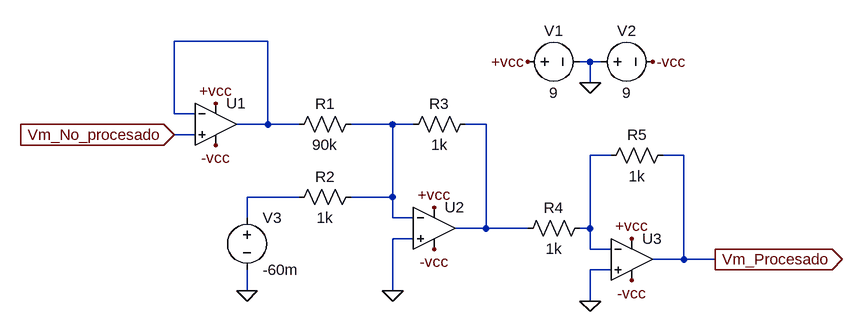
[diagram p0: schematic Modulo-Procesamiento.asc]
Modulo-Procesamiento.asc, the LTspice schematic file:
Version 4
SHEET 1 2272 680
WIRE 1264 -112 1120 -112
WIRE 1760 -80 1744 -80
WIRE 1776 -80 1760 -80
WIRE 1760 -48 1760 -80
WIRE 1120 0 1120 -112
WIRE 1152 0 1120 0
WIRE 1264 16 1264 -112
WIRE 1264 16 1216 16
WIRE 1312 16 1264 16
WIRE 1456 16 1392 16
WIRE 1488 16 1456 16
WIRE 1600 16 1568 16
WIRE 1152 32 1120 32
WIRE 1792 64 1760 64
WIRE 1904 64 1872 64
WIRE 1312 128 1232 128
WIRE 1456 128 1456 16
WIRE 1456 128 1392 128
WIRE 1232 160 1232 128
WIRE 1456 160 1456 128
WIRE 1488 160 1456 160
WIRE 1600 176 1600 16
WIRE 1600 176 1552 176
WIRE 1664 176 1600 176
WIRE 1760 176 1760 64
WIRE 1760 176 1744 176
WIRE 1488 192 1456 192
WIRE 1760 208 1760 176
WIRE 1792 208 1760 208
WIRE 1904 224 1904 64
WIRE 1904 224 1856 224
WIRE 1952 224 1904 224
WIRE 1792 240 1760 240
WIRE 1232 272 1232 240
WIRE 1456 272 1456 192
WIRE 1760 288 1760 240
FLAG 1760 -48 0
FLAG 1664 -80 +vcc
FLAG 1856 -80 -vcc
FLAG 1184 -16 +vcc
FLAG 1184 48 -vcc
FLAG 1456 272 0
FLAG 1232 272 0
FLAG 1520 208 -vcc
FLAG 1520 144 +vcc
FLAG 1824 256 -vcc
FLAG 1824 192 +vcc
FLAG 1760 288 0
FLAG 1952 224 Vm_Procesado
IOPIN 1952 224 Out
FLAG 1120 32 Vm_No_procesado
IOPIN 1120 32 In
SYMBOL OpAmps\\UniversalOpAmp 1184 16 R0
SYMATTR InstName U1
SYMBOL OpAmps\\UniversalOpAmp 1520 176 R0
SYMATTR InstName U2
SYMBOL OpAmps\\UniversalOpAmp 1824 224 R0
SYMATTR InstName U3
SYMBOL res 1408 0 R90
WINDOW 0 0 56 VBottom 2
WINDOW 3 32 56 VTop 2
SYMATTR InstName R1
SYMATTR Value 90k
SYMBOL res 1408 112 R90
WINDOW 0 0 56 VBottom 2
WINDOW 3 32 56 VTop 2
SYMATTR InstName R2
SYMATTR Value 1k
SYMBOL res 1760 160 R90
WINDOW 0 0 56 VBottom 2
WINDOW 3 32 56 VTop 2
SYMATTR InstName R4
SYMATTR Value 1k
SYMBOL res 1584 0 R90
WINDOW 0 0 56 VBottom 2
WINDOW 3 32 56 VTop 2
SYMATTR InstName R3
SYMATTR Value 1k
SYMBOL voltage 1648 -80 R270
WINDOW 0 32 56 VTop 2
WINDOW 3 -32 56 VBottom 2
WINDOW 123 0 0 Left 0
WINDOW 39 0 0 Left 0
SYMATTR InstName V1
SYMATTR Value 9
SYMBOL voltage 1760 -80 R270
WINDOW 0 32 56 VTop 2
WINDOW 3 -32 56 VBottom 2
WINDOW 123 0 0 Left 0
WINDOW 39 0 0 Left 0
SYMATTR InstName V2
SYMATTR Value 9
SYMBOL res 1888 48 R90
WINDOW 0 0 56 VBottom 2
WINDOW 3 32 56 VTop 2
SYMATTR InstName R5
SYMATTR Value 1k
SYMBOL voltage 1232 144 R0
WINDOW 123 0 0 Left 0
WINDOW 39 0 0 Left 0
SYMATTR InstName V3
SYMATTR Value -60m

The netlist it stands for:
* Modulo-Procesamiento.asc
XU1 Vm_No_procesado N001 +vcc -vcc N001 level1 Avol=1Meg GBW=10Meg Vos=0 En=0 Enk=0 In=0 Ink=0 Rin=500Meg  ; pins In+ In- V+ V- OUT
XU2 0 N002 +vcc -vcc N003 level1 Avol=1Meg GBW=10Meg Vos=0 En=0 Enk=0 In=0 Ink=0 Rin=500Meg  ; pins In+ In- V+ V- OUT
XU3 0 N004 +vcc -vcc Vm_Procesado level1 Avol=1Meg GBW=10Meg Vos=0 En=0 Enk=0 In=0 Ink=0 Rin=500Meg  ; pins In+ In- V+ V- OUT
R1 N002 N001 90k
R2 N002 N005 1k
R4 N004 N003 1k
R3 N003 N002 1k
V1 +vcc 0 9
V2 0 -vcc 9
R5 Vm_Procesado N004 1k
V3 N005 0 -60m
.lib UniversalOpAmp1.lib
.backanno
.end